# Altium schematic sheet SFR_PORTS.SCHDOC
size A3; Organization: Altium Limited; Address1: L3, 12a Rodborough Rd; Address2: Frenchs Forest; Address3: NSW; Address4: Australia 2086; DocumentNumber: 3; SheetNumber: 3; SheetTotal: 12
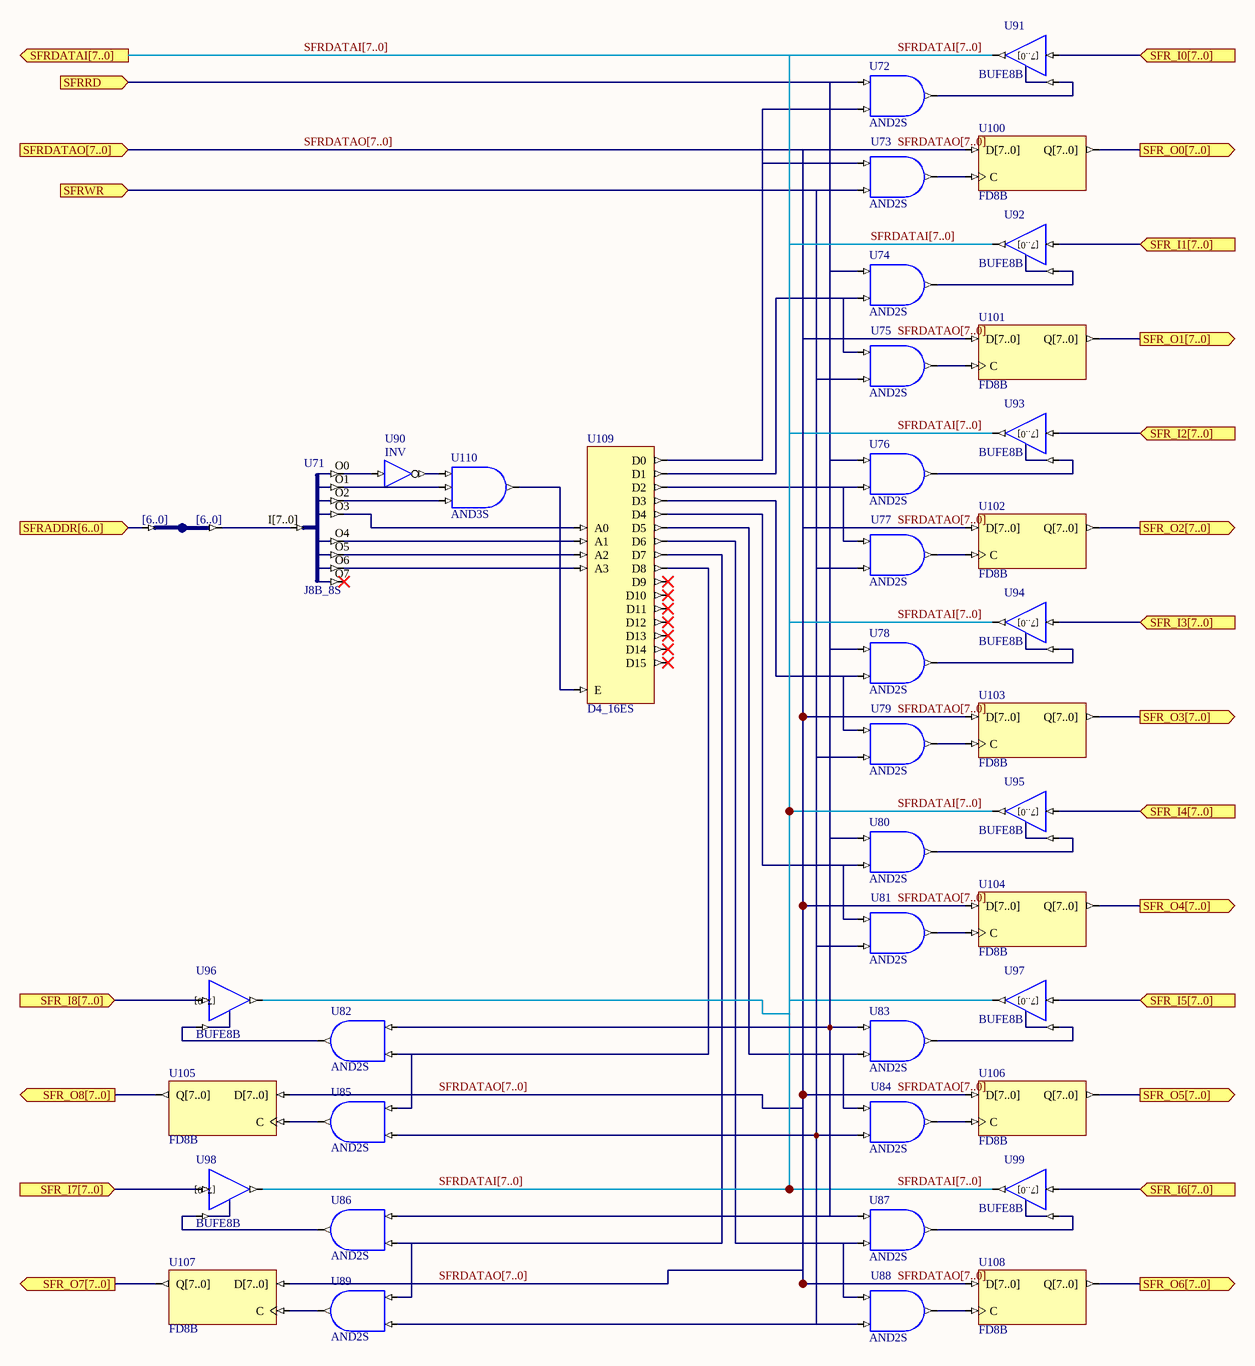
[diagram p0: SFR_PORTS.SCHDOC]

## Parts
JB_S4  IndexA: [6..0]  (hidden comment: JB)
U71  J8B_8S
U72  AND2S
U73  AND2S
U74  AND2S
U75  AND2S
U76  AND2S
U77  AND2S
U78  AND2S
U79  AND2S
U80  AND2S
U81  AND2S
U82  AND2S
U83  AND2S
U84  AND2S
U85  AND2S
U86  AND2S
U87  AND2S
U88  AND2S
U89  AND2S
U90  INV
U91  BUFE8B
U92  BUFE8B
U93  BUFE8B
U94  BUFE8B
U95  BUFE8B
U96  BUFE8B
U97  BUFE8B
U98  BUFE8B
U99  BUFE8B
U100  FD8B
U101  FD8B
U102  FD8B
U103  FD8B
U104  FD8B
U105  FD8B
U106  FD8B
U107  FD8B
U108  FD8B
U109  D4_16ES
U110  AND3S

## Ports
SFR_I0[7..0] (in), SFR_I1[7..0] (in), SFR_I2[7..0] (in), SFR_I3[7..0] (in), SFR_I4[7..0] (in), SFR_I5[7..0] (in), SFR_I6[7..0] (in), SFR_I7[7..0] (in), SFR_I8[7..0] (in), SFR_O0[7..0] (out), SFR_O1[7..0] (out), SFR_O2[7..0] (out), SFR_O3[7..0] (out), SFR_O4[7..0] (out), SFR_O5[7..0] (out), SFR_O6[7..0] (out), SFR_O7[7..0] (out), SFR_O8[7..0] (out), SFRADDR[6..0] (in), SFRDATAI[7..0] (out), SFRDATAO[7..0] (in), SFRRD (in), SFRWR (in)

## Nets
SFR_I0[7..0]: U91.I[7..0] ; port SFR_I0[7..0]
SFR_I1[7..0]: U92.I[7..0] ; port SFR_I1[7..0]
SFR_I2[7..0]: U93.I[7..0] ; port SFR_I2[7..0]
SFR_I3[7..0]: U94.I[7..0] ; port SFR_I3[7..0]
SFR_I4[7..0]: U95.I[7..0] ; port SFR_I4[7..0]
SFR_I5[7..0]: U97.I[7..0] ; port SFR_I5[7..0]
SFR_I6[7..0]: U99.I[7..0] ; port SFR_I6[7..0]
SFR_I7[7..0]: U98.I[7..0] ; port SFR_I7[7..0]
SFR_I8[7..0]: U96.I[7..0] ; port SFR_I8[7..0]
SFR_O0[7..0]: U100.Q[7..0] ; port SFR_O0[7..0]
SFR_O1[7..0]: U101.Q[7..0] ; port SFR_O1[7..0]
SFR_O2[7..0]: U102.Q[7..0] ; port SFR_O2[7..0]
SFR_O3[7..0]: U103.Q[7..0] ; port SFR_O3[7..0]
SFR_O4[7..0]: U104.Q[7..0] ; port SFR_O4[7..0]
SFR_O5[7..0]: U106.Q[7..0] ; port SFR_O5[7..0]
SFR_O6[7..0]: U108.Q[7..0] ; port SFR_O6[7..0]
SFR_O7[7..0]: U107.Q[7..0] ; port SFR_O7[7..0]
SFR_O8[7..0]: U105.Q[7..0] ; port SFR_O8[7..0]
SFRADDR[6..0]: JB_S4.A[0..0](IA[0..0]) ; port SFRADDR[6..0]
SFRDATAI[7..0]: U91.O[7..0] U92.O[7..0] U93.O[7..0] U94.O[7..0] U95.O[7..0] U96.O[7..0] U97.O[7..0] U98.O[7..0] U99.O[7..0] ; port SFRDATAI[7..0]
SFRDATAO[7..0]: U100.D[7..0] U101.D[7..0] U102.D[7..0] U103.D[7..0] U104.D[7..0] U105.D[7..0] U106.D[7..0] U107.D[7..0] U108.D[7..0] ; port SFRDATAO[7..0]
SFRRD: U72.I0 U74.I0 U76.I0 U78.I0 U80.I0 U82.I0 U83.I0 U86.I0 U87.I0 ; port SFRRD
SFRWR: U73.I1 U75.I1 U77.I1 U79.I1 U81.I1 U84.I1 U85.I1 U88.I1 U89.I1 ; port SFRWR
NetJB_S4_B[0..0]: JB_S4.B[0..0] U71.I[7..0]
NetU71_O0: U71.O0 U90.I
NetU71_O1: U71.O1 U110.I1
NetU71_O2: U71.O2 U110.I2
NetU71_O3: U71.O3 U109.A0
NetU71_O4: U71.O4 U109.A1
NetU71_O5: U71.O5 U109.A2
NetU71_O6: U71.O6 U109.A3
NetU72_I1: U72.I1 U73.I0 U109.D0
NetU72_O: U72.O U91.E
NetU73_O: U73.O U100.C
NetU74_I1: U74.I1 U75.I0 U109.D1
NetU74_O: U74.O U92.E
NetU75_O: U75.O U101.C
NetU76_I1: U76.I1 U77.I0 U109.D2
NetU76_O: U76.O U93.E
NetU77_O: U77.O U102.C
NetU78_I1: U78.I1 U79.I0 U109.D3
NetU78_O: U78.O U94.E
NetU79_O: U79.O U103.C
NetU80_I1: U80.I1 U81.I0 U109.D4
NetU80_O: U80.O U95.E
NetU81_O: U81.O U104.C
NetU82_I1: U82.I1 U85.I0 U109.D8
NetU82_O: U82.O U96.E
NetU83_I1: U83.I1 U84.I0 U109.D5
NetU83_O: U83.O U97.E
NetU84_O: U84.O U106.C
NetU85_O: U85.O U105.C
NetU86_I1: U86.I1 U89.I0 U109.D7
NetU86_O: U86.O U98.E
NetU87_I1: U87.I1 U88.I0 U109.D6
NetU87_O: U87.O U99.E
NetU88_O: U88.O U108.C
NetU89_O: U89.O U107.C
NetU90_O: U90.O U110.I0
NetU109_E: U109.E U110.O

Not connected (* = marked no-connect by the designer): U71 O7*; U109 D9* D10* D11* D12* D13* D14* D15*

## Buses and harness runs
bus SFRDATAI[7..0] = port SFRDATAI[7..0]
bus SFRDATAO[7..0] = port SFRDATAO[7..0]

## Notes on the sheet
- Title
- Size:
- Date:
- A3
- Number:
- Time:
- Revision:
- Sheet
- of
- File:
- (in symbol BUFE8B) [7..0]

## Library data of the parts
JB_S4 = JB: System Joiner; ArchiveName: GENERIC; Published: 7-Nov-2003; Publisher: Altium Limited; Core Revision: 1.00.00; IndexB: [6..0]
U71 = J8B_8S: 8-Bit input bus to 8 single pin outputs; ArchiveName: GENERIC; Published: 7-Nov-2003; Publisher: Altium Limited; Core Revision: 1.00.00
U72-U89 = AND2S: 2-Input AND Gate, Single Pin Version; Xilinx Equivalent: AND2; ArchiveName: GENERIC; Published: 7-Nov-2003; Publisher: Altium Limited; Core Revision: 1.00.00
U90 = INV: Inverter; ArchiveName: GENERIC; Published: 7-Nov-2003; Publisher: Altium Limited; Xilinx Equivalent: INV; Core Revision: 1.00.00
U91-U99 = BUFE8B: 8-Bit 3-state Buffer with Active High Enable, Bus Version; Xilinx Equivalent: BUFE8; ArchiveName: GENERIC; Published: 7-Nov-2003; Publisher: Altium Limited; Core Revision: 1.00.00
U100-U108 = FD8B: 8-Bit D-Type Flip-Flop, Bus Version; Xilinx Equivalent: FD8; ArchiveName: GENERIC; Published: 7-Nov-2003; Publisher: Altium Limited; Core Revision: 1.00.00
U109 = D4_16ES: Binary 4- to 16-Bit Decoder with Enable, Single Pin Version; Xilinx Equivalent: D4_16E; ArchiveName: GENERIC; Published: 7-Nov-2003; Publisher: Altium Limited; Core Revision: 1.00.00
U110 = AND3S: 3-Input AND Gate, Single Pin Version; Xilinx Equivalent: AND3; ArchiveName: GENERIC; Published: 7-Nov-2003; Publisher: Altium Limited; Core Revision: 1.00.00